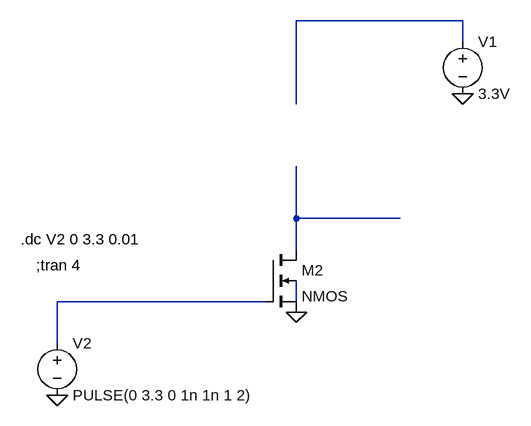
[diagram p0: schematic nmos_inverter.asc]
nmos_inverter.asc, the LTspice schematic file:
Version 4
SHEET 1 880 680
WIRE 480 -80 224 -80
WIRE 480 -48 480 -80
WIRE 224 48 224 -80
WIRE 224 224 224 144
WIRE 384 224 224 224
WIRE 224 272 224 224
WIRE 176 352 -144 352
WIRE 224 352 224 320
WIRE -144 416 -144 352
FLAG 480 32 0
FLAG -144 496 0
FLAG 224 368 0
SYMBOL nmos4 176 272 R0
SYMATTR InstName M2
SYMBOL voltage 480 -64 R0
SYMATTR InstName V1
SYMATTR Value 3.3V
SYMBOL voltage -144 400 R0
SYMATTR InstName V2
SYMATTR Value PULSE(0 3.3 0 1n 1n 1 2)
TEXT -176 296 Left 2 !;tran 4
TEXT -200 256 Left 2 !.dc V2 0 3.3 0.01

The netlist it stands for:
* nmos_inverter.asc
M2 N002 N003 0 N004 NMOS
V1 N001 0 3.3V
V2 N003 0 PULSE(0 3.3 0 1n 1n 1 2)
.model NMOS NMOS
.model PMOS PMOS
.lib standard.mos
;tran 4
.dc V2 0 3.3 0.01
.backanno
.end